# Altium project STM32 kernel.PrjPcb
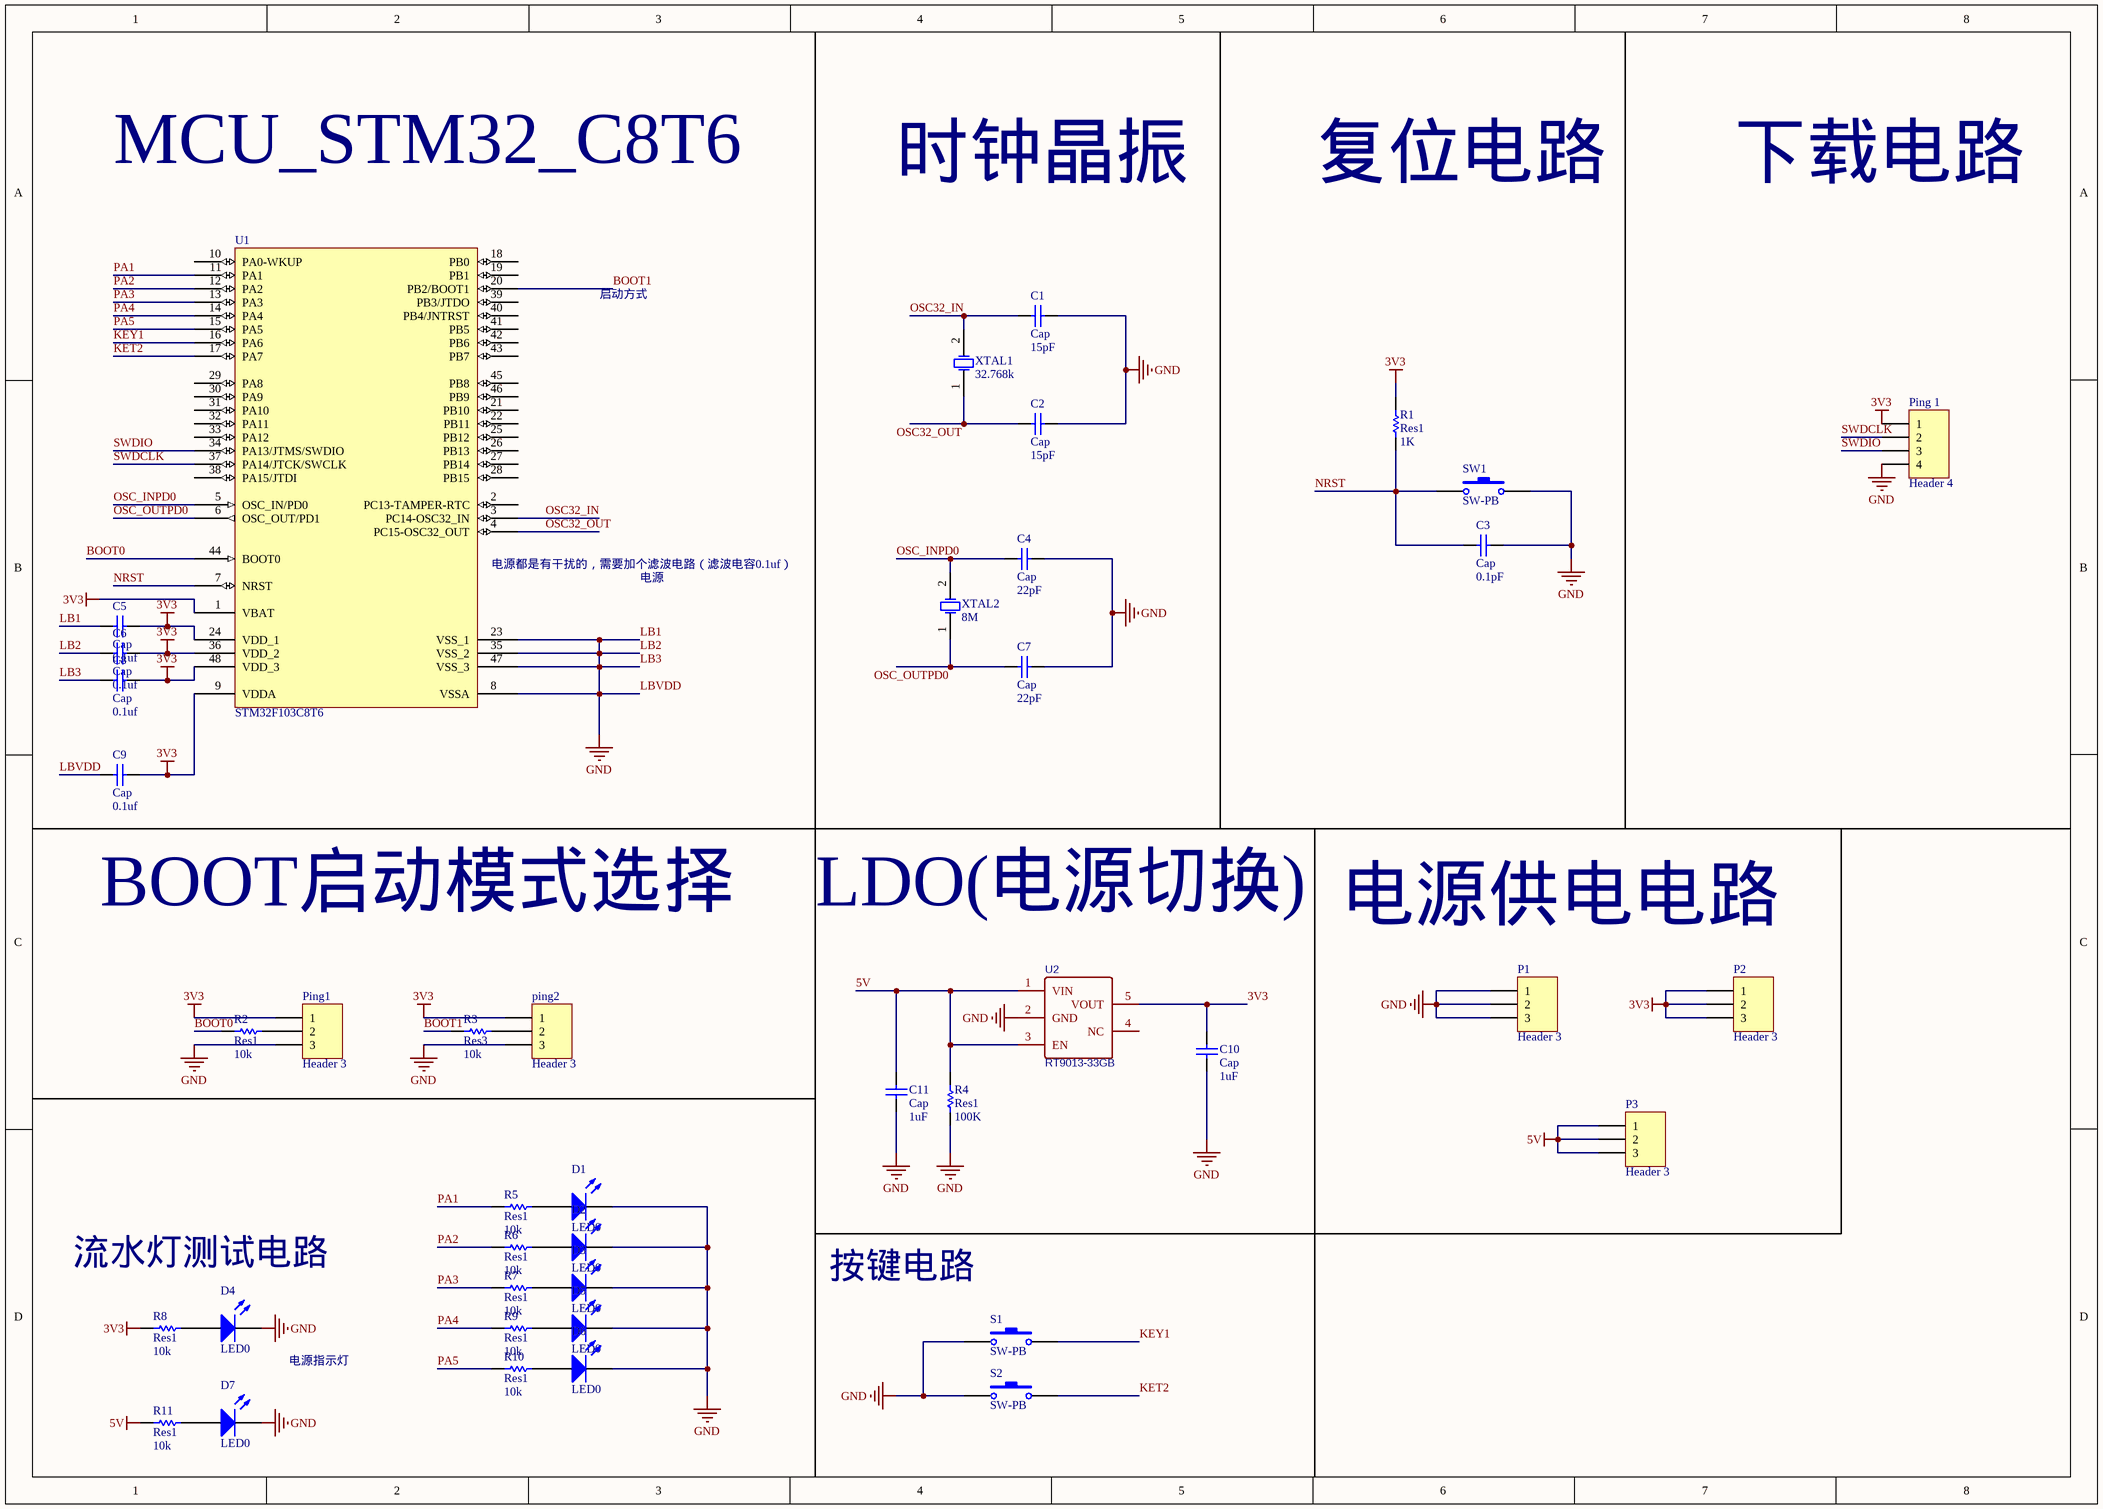
[diagram p0: Sheet1.SchDoc]
1 sheet, 42 parts. Net scope: global (net labels, ports and power ports of the same name join across sheets).
Board file: PCB1.PcbDoc

## Sheet Sheet1.SchDoc
size A3

### Parts
C1  Cap  value 15pF  [RAD-0.3]
C2  Cap  value 15pF  [RAD-0.3]
C3  Cap  value 0.1pF  [RAD-0.3]
C4  Cap  value 22pF  [RAD-0.3]
C5  Cap  value 0.1uf  [RAD-0.3]
C6  Cap  value 0.1uf  [RAD-0.3]
C7  Cap  value 22pF  [RAD-0.3]
C8  Cap  value 0.1uf  [RAD-0.3]
C9  Cap  value 0.1uf  [RAD-0.3]
C10  Cap  value 1uF  [RAD-0.3]
C11  Cap  value 1uF  [RAD-0.3]
D1  LED0  [LED-0]
D2  LED0  [LED-0]
D3  LED0  [LED-0]
D4  LED0  [LED-0]
D5  LED0  [LED-0]
D6  LED0  [LED-0]
D7  LED0  [LED-0]
P1  Header 3  [HDR1X3]
P2  Header 3  [HDR1X3]
P3  Header 3  [HDR1X3]
Ping1  Header 3  [HDR1X3]
ping2  Header 3  [HDR1X3]
Ping_1  Header 4  [HDR1X4]
R1  Res1  value 1K  [AXIAL-0.3]
R2  Res1  value 10k  [AXIAL-0.3]
R3  Res3  value 10k  [AXIAL-0.3]
R4  Res1  value 100K  [AXIAL-0.3]
R5  Res1  value 10k  [AXIAL-0.3]
R6  Res1  value 10k  [AXIAL-0.3]
R7  Res1  value 10k  [AXIAL-0.3]
R8  Res1  value 10k  [AXIAL-0.3]
R9  Res1  value 10k  [AXIAL-0.3]
R10  Res1  value 10k  [AXIAL-0.3]
R11  Res1  value 10k  [AXIAL-0.3]
S1  SW-PB  [SPST-2]
S2  SW-PB  [SPST-2]
SW1  SW-PB  [SPST-2]
U1  STM32F103C8T6  [LQFP48_N]
U2  RT9013-33GB  [SOT-23-5_L3.0-W1.7-P0.95-LS2.8-BR]
XTAL1  32.768k  [R38]
XTAL2  8M  [R38]

### Nets
3V3: C5.2 C6.2 C8.2 C9.2 C10.2 P2.1 P2.2 P2.3 Ping1.1 ping2.1 Ping_1.1 R1.2 R8.1 U1.1(VBAT) U1.9(VDDA) U1.24(VDD_1) U1.36(VDD_2) U1.48(VDD_3) U2.5(VOUT)
5V: C11.2 P3.1 P3.2 P3.3 R4.2 R11.1 U2.1(VIN) U2.3(EN)
LB1: C1.2 C2.1 C3.2 C4.2 C5.1 C6.1 C7.1 C8.1 C9.1 C10.1 C11.1 D1.2(K) D2.2(K) D3.2(K) D4.2(K) D5.2(K) D6.2(K) D7.2(K) P1.1 P1.2 P1.3 Ping1.3 ping2.3 Ping_1.4 R4.1 S1.1 S2.1 SW1.2 U1.8(VSSA) U1.23(VSS_1) U1.35(VSS_2) U1.47(VSS_3) U2.2(GND)  [also labelled GND, LB2, LB3, LBVDD]
BOOT0: R2.1 U1.44(BOOT0)
BOOT1: R3.1 U1.20(PB2/BOOT1)
KET2: S2.2 U1.17(PA7)
KEY1: S1.2 U1.16(PA6)
NRST: C3.1 R1.1 SW1.1 U1.7(NRST)
OSC32_IN: C1.1 U1.3(PC14-OSC32_IN) XTAL1.2(OSC2)
OSC32_OUT: C2.2 U1.4(PC15-OSC32_OUT) XTAL1.1(OSC1)
OSC_INPD0: C4.1 U1.5(OSC_IN/PD0) XTAL2.2(OSC2)
OSC_OUTPD0: C7.2 U1.6(OSC_OUT/PD1) XTAL2.1(OSC1)
PA1: R5.1 U1.11(PA1)
PA2: R6.1 U1.12(PA2)
PA3: R7.1 U1.13(PA3)
PA4: R9.1 U1.14(PA4)
PA5: R10.1 U1.15(PA5)
SWDCLK: Ping_1.2 U1.37(PA14/JTCK/SWCLK)
SWDIO: Ping_1.3 U1.34(PA13/JTMS/SWDIO)
NetD1_1: D1.1(A) R5.2
NetD2_1: D2.1(A) R6.2
NetD3_1: D3.1(A) R7.2
NetD4_1: D4.1(A) R8.2
NetD5_1: D5.1(A) R9.2
NetD6_1: D6.1(A) R10.2
NetD7_1: D7.1(A) R11.2
NetPing1_2: Ping1.2 R2.2
Netping2_2: ping2.2 R3.2

Not connected (* = marked no-connect by the designer): U1 2(PC13-TAMPER-RTC) 10(PA0-WKUP) 18(PB0) 19(PB1) 21(PB10) 22(PB11) 25(PB12) 26(PB13) 27(PB14) 28(PB15) 29(PA8) 30(PA9) 31(PA10) 32(PA11) 33(PA12) 38(PA15/JTDI) 39(PB3/JTDO) 40(PB4/JNTRST) 41(PB5) 42(PB6) 43(PB7) 45(PB8) 46(PB9); U2 4(NC)

### Notes on the sheet
- MCU_STM32_C8T6
- 时钟晶振
- 复位电路
- 下载电路
- 启动方式
- (near U1) 电源都是有干扰的，需要加个滤波电路（滤波电容0.1uf）
- 电源
- BOOT启动模式选择
- LDO(电源切换)
- 电源供电电路
- 流水灯测试电路
- 按键电路
- 电源指示灯

### Library data of the parts
C1-C11 = Cap: Capacitor; Published: 8-Jun-2000; LatestRevisionDate: 17-Jul-2002; LatestRevisionNote: Re-released for DXP Platform.; PackageReference: RAD-0.3; Publisher: Altium Limited; PackageDescription: Radial Cap, Thru-Hole; 2 Leads; 0.3 in Pin Spacing
D1-D7 = LED0: Typical INFRARED GaAs LED; Published: 8-Jun-2000; LatestRevisionDate: 08-Jul-2005; LatestRevisionNote: Mech Layer 1 removed.; PackageReference: LED-0; Publisher: Altium Limited; PackageDescription: LED; 2 Leads
P1-P3 Ping1 ping2 = Header 3: Header, 3-Pin; LatestRevisionDate: 17-Jul-2002; LatestRevisionNote: Re-released for DXP Platform.; Publisher: Altium Limited
Ping_1 = Header 4: Header, 4-Pin; LatestRevisionDate: 17-Jul-2002; LatestRevisionNote: Re-released for DXP Platform.; Publisher: Altium Limited
R1-R11 = Res1: Resistor; Published: 8-Jun-2000; LatestRevisionDate: 17-Jul-2002; LatestRevisionNote: Re-released for DXP Platform.; PackageReference: AXIAL-0.3; Publisher: Altium Limited; PackageDescription: Axial Device, Thru-Hole; 2 Leads; 0.3 in Pin Spacing
S1 S2 SW1 = SW-PB: Switch; Published: 24-Mar-1999; LatestRevisionDate: 17-Jul-2002; LatestRevisionNote: Re-released for DXP Platform.; PackageReference: SPST-2; Publisher: Altium Limited; PackageDescription: Switch; 2 Leads
U1 = STM32F103C8T6: STM32 ARM-based 32-bit MCU with 64 Kbytes Flash, 48-pin LQFP, Industrial Temperature; Published: 30-May-2008; DatasheetVersion: rev6, Mar-2008; PackageVersion: Mar-2008; PackageReference: LQFP48; Publisher: Altium Limited; PackageDescription: 48-Pin Low-Profile Quad Flat Pack, 7 x 7 mm Body, 0.5 mm Pitch (LQFP48); ComponentLink1Description: Manufacturer Link; ComponentLink1URL: www.st.com/stm32; ComponentLink2Description: Datasheet; ComponentLink2URL: http://www.st.com/stonline/products/literature/ds/13587.pdf
U2 = RT9013-33GB: BOM_Manufacturer: RICHTEK; BOM_Supplier: LCSC; BOM_Manufacturer Part: RT9013-33GB; BOM_Supplier Part: C47773; BOM_JLCPCB Part Class: Extended Part; spicePre: U; spiceSymbolName: RT9013-33GB
XTAL1 XTAL2 = XTAL: Crystal Oscillator; Published: 8-Jun-2000; LatestRevisionDate: 17-Jul-2002; LatestRevisionNote: Re-released for DXP Platform.; PackageReference: R38; Publisher: Altium Limited; PackageDescription: Crystal, Thru-Hole; 2 Leads; Body 3.1 x 8.2 mm (Dia.xH)